# EAGLE design rc-driver-dual (EAGLE 7.2.0)
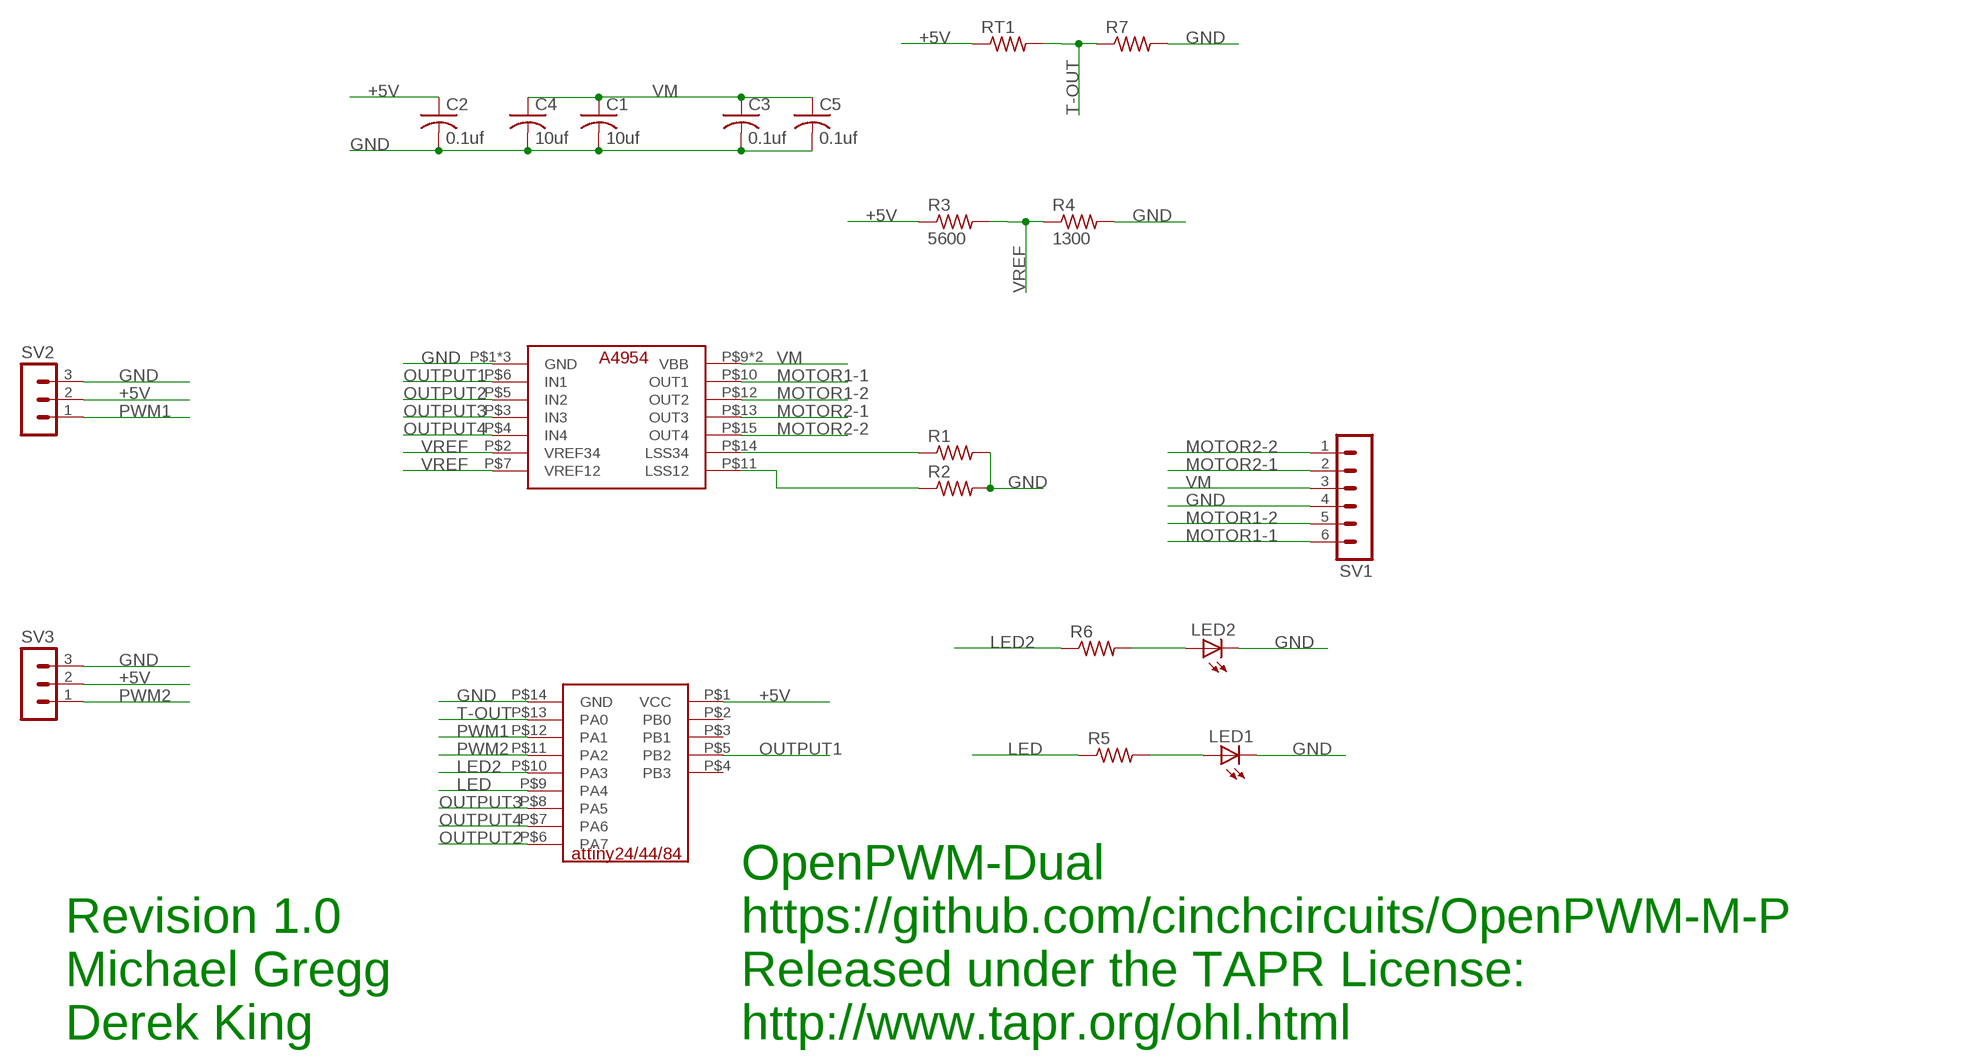
[diagram p0: schematic, sheet 1]

## Parts
C1  10uf  C-USC1206  [C1206]
C2  0.1uf  C-USC0603  [C0603]
C3  0.1uf  C-USC0603  [C0603]
C4  10uf  C-USC1206  [C1206]
C5  0.1uf  C-USC0603  [C0603]
LED1  LEDCHIPLED_0603  [CHIPLED_0603]
LED2  LEDCHIPLED_0603  [CHIPLED_0603]
R1  R-US_R0805W  [R0805W]
R2  R-US_R0805W  [R0805W]
R3  5600  R-US_R0603  [R0603]
R4  1300  R-US_R0603  [R0603]
R5  R-US_R0603  [R0603]
R6  R-US_R0603  [R0603]
R7  R-US_R0603  [R0603]
RT1  R-US_R0603  [R0603]
SV1  MA06-1  [MA06-1]
SV2  MA03-1  [MA03-1]
SV3  MA03-1  [MA03-1]
U$1  ATTINY24A  [SOIC-14-WIDE]
U$2  A4954-DUAL-HBRIDGE  [TSSOP-16-LP]

## Nets
+5V: C2.1 R3.1 RT1.1 SV2.2 SV3.2 U$1.P$1(VCC)
GND: C1.2 C2.2 C3.2 C4.2 C5.2 LED1.C LED2.C R1.2 R2.2 R4.2 R7.2 SV1.4 SV2.3 SV3.3 U$1.P$14(GND) U$2.P$1(GND) U$2.P$8(GND) U$2.P$17(GND)
LED: R5.1 U$1.P$9(PA4)
LED2: R6.1 U$1.P$10(PA3)
MOTOR1-1: SV1.6 U$2.P$10(OUT1)
MOTOR1-2: SV1.5 U$2.P$12(OUT2)
MOTOR2-1: SV1.2 U$2.P$13(OUT3)
MOTOR2-2: SV1.1 U$2.P$15(OUT4)
N$1: R1.1 U$2.P$14(LSS34)
N$2: R2.1 U$2.P$11(LSS12)
N$3: LED2.A R6.2
N$4: LED1.A R5.2
OUTPUT1: U$1.P$5(PB2) U$2.P$6(IN1)
OUTPUT2: U$1.P$6(PA7) U$2.P$5(IN2)
OUTPUT3: U$1.P$8(PA5) U$2.P$3(IN3)
OUTPUT4: U$1.P$7(PA6) U$2.P$4(IN4)
PWM1: SV2.1 U$1.P$12(PA1)
PWM2: SV3.1 U$1.P$11(PA2)
T-OUT: R7.1 RT1.2 U$1.P$13(PA0)
VM: C1.1 C3.1 C4.1 C5.1 SV1.3 U$2.P$9(VBB) U$2.P$16(VBB)
VREF: R3.2 R4.1 U$2.P$2(VREF34) U$2.P$7(VREF12)
Unconnected: U$1.P$2(PB0) U$1.P$3(PB1) U$1.P$4(PB3)

## Notes on the sheet
- OpenPWM-Dual
- Revision 1.0 | https://github.com/cinchcircuits/OpenPWM-M-P
- Michael Gregg | Released under the TAPR License:
- Derek King | http://www.tapr.org/ohl.html

## Library data of the parts
C1-C5 = resistor:C-US: CAPACITOR, American symbol
LED1 LED2 = led:LED: LED OSRAM: - CHIPLED LG R971, LG N971, LY N971, LG Q971, LY Q971, LO R971, LY R971 LH N974, LH R974 LS Q976, LO Q976, LY Q976 LO Q996 - Hyper CHIPLED LW Q18S LB Q993, LB Q99A, LB R99A - SideLED LS A670, LO A670, LY A670, LG A670, LP A670 LB A673, LV A673, LT A673, LW A673 LH A674 LY A675 LS A676, LA A676, LO A676, LY A676, LW A676 LS A679, LY A679, LG A679 - Hyper Micro SIDELED® LS Y876, LA Y876, LO Y876, LY Y876 LT Y87S - SmartLED LW L88C, LW L88S LB L89C, LB L89S, LG L890 LS L89K, LO L89K, LY L89K LS L896, LA L896, LO L896, LY L896 - TOPLED LS T670, LO T670, LY T670, LG T670, LP T670 LSG T670, LSP T670, LSY T670, LOP T670, LYG T670 LG T671, LOG T671, LSG T671 LB T673, LV T673, LT T673, LW T673 LH T674 LS T676, LA T676, LO T676, LY T676, LB T676, LH T676, LSB T676, LW T676 LB T67C, LV T67C, LT T67C, LS T67K, LO T67K, LY T67K, LW E67C LS E67B, LA E67B, LO E67B, LY E67B, LB E67C, LV E67C, LT E67C LW T67C LS T679, LY T679, LG T679 LS T770, LO T770, LY T770, LG T770, LP T770 LB T773, LV T773, LT T773, LW T773 LH T774 LS E675, LA E675, LY E675, LS T675 LS T776, LA T776, LO T776, LY T776, LB T776 LHGB T686 LT T68C, LB T68C - Hyper Mini TOPLED® LB M676 - Mini TOPLED Santana® LG M470 LS M47K, LO M47K, LY M47K Source: http://www.osram.convergy.de LUXEON: - LUMILED® LXK2-PW12-R00, LXK2-PW12-S00, LXK2-PW14-U00, LXK2-PW14-V00 LXK2-PM12-R00, LXK2-PM12-S00, LXK2-PM14-U00 LXK2-PE12-Q00, LXK2-PE12-R00, LXK2-PE12-S00, LXK2-PE14-T00, LXK2-PE14-U00 LXK2-PB12-K00, LXK2-PB12-L00, LXK2-PB12-M00, LXK2-PB14-N00, LXK2-PB14-P00, LXK2-PB14-Q00 LXK2-PR12-L00, LXK2-PR12-M00, LXK2-PR14-Q00, LXK2-PR14-R00 LXK2-PD12-Q00, LXK2-PD12-R00, LXK2-PD12-S00 LXK2-PH12-R00, LXK2-PH12-S00 LXK2-PL12-P00, LXK2-PL12-Q00, LXK2-PL12-R00 Source: www.luxeon.com KINGBRIGHT: KA-3528ASYC Source: www.kingbright.com
R1-R7 RT1 = resistor:R-US_: RESISTOR, American symbol
SV1 = con-lstb:MA06-1: PIN HEADER; OC_FARNELL: unknown; OC_NEWARK: unknown
SV2 SV3 = con-lstb:MA03-1: PIN HEADER; OC_FARNELL: unknown; OC_NEWARK: unknown
U$1 = rc-parts:ATTINY24A
U$2 = rc-parts:A4954-DUAL-HBRIDGE

## Board
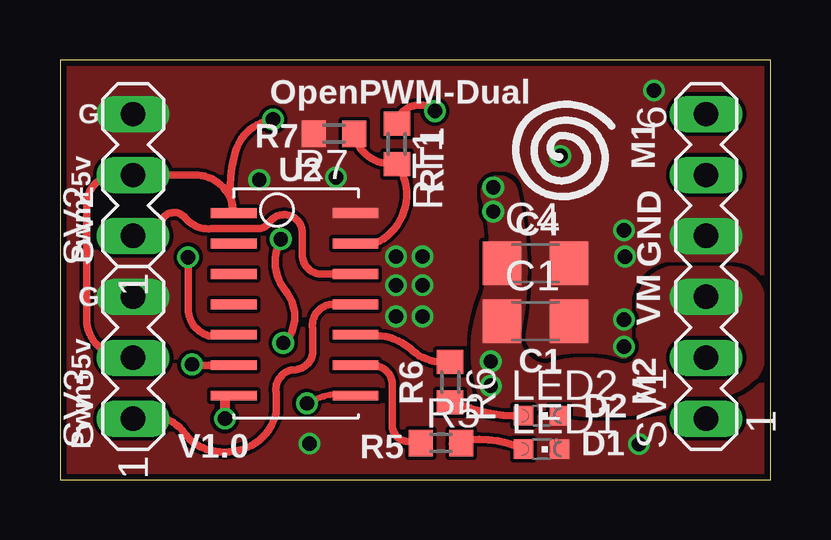
[diagram p1: board, top side]
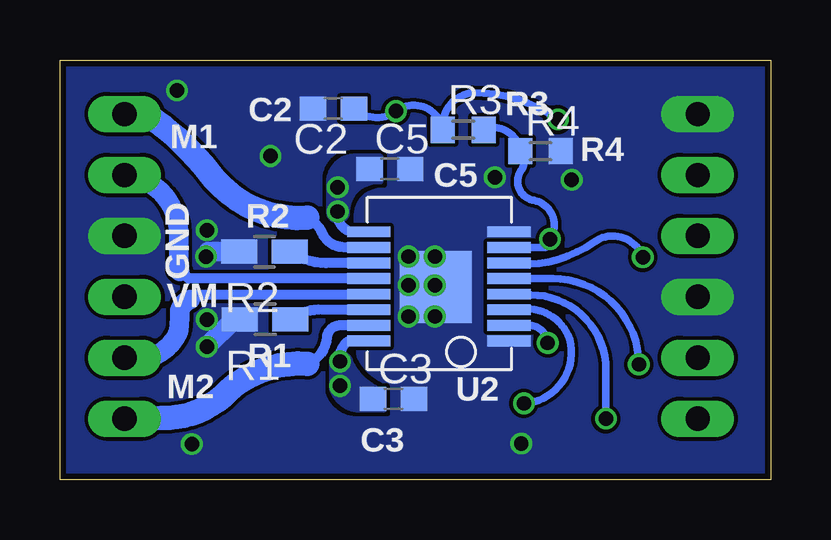
[diagram p2: board, bottom side, seen from below]

Size 29.62 x 17.5 mm. Coordinates in mm from the lower left corner, seen from the top.
Outline: 0,0 29.62,0 29.62,17.5 0,17.5 0,0
Copper layers (1*16): Top 0.035mm / dielectric 1.5mm / Bottom 0.035mm
Design rules "SeeedStudio_2layer_DRU_no_angle_20140221": minimum track width 6mil, minimum drill 12mil, track to track 6mil, track to pad 6mil, pad to pad 6mil, via to via 6mil, smd to smd 0mil, copper to edge 10mil, drill to drill 10mil, minimum pad ring 10mil, minimum via ring 6mil, stop-mask expansion 2mil, vias tented up to drill 100mil, thermal gap 10mil

### Footprints (pad centres in the part's own frame; a part is rotated, then mirrored left to right if it is on the bottom)
C1206 = smd 1.6 x 1.8: 1 -1.4,0; 2 1.4,0
C0603 = smd 1.1 x 1: 1 -0.85,0; 2 0.85,0
CHIPLED_0603 = smd 0.8 x 0.8: A 0,-0.75; C 0,0.75
R0805W = smd 1.5 x 1: 1 -1.052,0; 2 1.052,0
R0603 = smd 1 x 1.1: 1 -0.85,0; 2 0.85,0
MA06-1 = drill 1.016 long: 1 -6.35,0; 2 -3.81,0; 3 -1.27,0; 4 1.27,0; 5 3.81,0; 6 6.35,0
MA03-1 = drill 1.016 long: 1 -2.54,0; 2 0,0; 3 2.54,0
SOIC-14-WIDE = smd 0.4 x 1.9: P$1 -2.54,-2.54; P$2 -1.27,-2.54; P$3 0,-2.54; P$4 1.27,-2.54; P$5 2.54,-2.54; P$6 3.81,-2.54; P$7 5.08,-2.54; P$8 5.08,2.54; P$9 3.81,2.54; P$10 2.54,2.54; P$11 1.27,2.54; P$12 0,2.54; P$13 -1.27,2.54; P$14 -2.54,2.54
TSSOP-16-LP = smd 0.45 x 1.8: P$1 -2.07,-3.24; P$2 -1.42,-3.24; P$3 -0.77,-3.24; P$4 -0.12,-3.24; P$5 0.53,-3.24; P$6 1.18,-3.24; P$7 1.83,-3.24; P$8 2.48,-3.24; P$9 2.48,2.61; P$10 1.83,2.61; P$11 1.18,2.61; P$12 0.53,2.61; P$13 -0.12,2.61; P$14 -0.77,2.61; P$15 -1.42,2.61; P$16 -2.07,2.61 | smd 3 x 3: P$17 0.18,-0.19

### Placement (x,y rotation side)
C1  19.81,6.6 0 top
C2  18.23,15.48 180 bottom
C3  15.72,3.36 0 bottom
C4  19.81,9.02 0 top
C5  15.88,12.95 0 bottom
LED1  GREEN  [CHIPLED_0603]  20.07,1.27 270 top
LED2  RED  [CHIPLED_0603]  20.07,2.67 270 top
R1  0.047  [R0805W]  21.07,6.68 180 bottom
R2  0.047  [R0805W]  21.09,9.51 180 bottom
R3  12.82,14.59 0 bottom
R4  9.6,13.7 0 bottom
R5  360  [R0603]  15.88,1.52 0 top
R6  360  [R0603]  16.26,4.06 270 top
R7  11.42,14.42 180 top
RT1  14.04,14 270 top
SV1  26.92,8.89 90 top
SV2  3.05,12.7 90 top
SV3  3.05,5.08 90 top
U$1  9.78,8.57 270 top
U$2  14.15,7.85 90 bottom

### Tracks (layer width: path | path; a pad name or v marks a point on that pad's centre or on a via)
+5V  (via drill 0.6)
  Top 0.305: v8.87,15.02 arc73 7.24,13.38 arc30 U$1.P$1 arc90 5.59,12.7 SV2.2 2.32,12.7 arc90 1.11,11.44 1.11,6.54 arc90 SV3.2 | RT1.1 arc-121 v15.62,15.37
  Bottom 0.305: v8.87,15.02 arc-37 12.45,16.13 arc-90 R3.1 arc-117 v15.62,15.37 arc81 C2.1
GND  (via drill 0.6)
  Bottom 0.813: R1.2 22.36,6.68 v23.5,5.55 | v23.54,9.3 23.44,9.51 R2.2
  other vias: 15.1,9.3 14,8.1 15.1,8.1 14,6.8 15.1,6.8 23.5,6.67 23.5,10.4 24.75,16.23 24.13,1.48 20.85,13.49 8.3,12.5 10.4,1.5 11.5,12.6 14,9.3
  pour Bottom (rank 2, no thermals): 29.61,0 29.61,17.52 0,17.52 0,0
  pour Top (rank 2, no thermals): 29.61,17.52 0,17.52 0,0 29.61,0
LED
  Top 0.305: U$1.P$9 13.02,4.76 arc-80 13.84,4.06 13.84,2.29 arc82 14.4,1.6 R5.1
LED2
  Top 0.305: R6.1 arc-48 14.71,5.36 arc43 13.17,6 12.35,6 arc-90 U$1.P$10
MOTOR1-1
  Bottom 0.406: U$2.P$10 17.78,9.68 17.9,9.7 arc62 18.7,10.3 arc-37 19.32,10.92
  Bottom 0.813: SV1.6 26.66,15.2
  Bottom 1.016: 19.32,10.92 arc53 23.18,12.52 arc-19 25.96,15.2 26.66,15.2
MOTOR1-2
  Bottom 0.406: U$2.P$12 24.26,8.38 24.32,8.44 24.32,8.46 24.63,8.67
  Bottom 0.813: 24.63,8.67 24.68,8.73 24.68,10.08 arc-83 26.7,12.68 SV1.5
MOTOR2-1
  Bottom 0.406: U$2.P$13 16.79,7.7 23.96,7.7 24.13,7.62 24.27,7.53 24.19,7.51
  Bottom 0.813: 24.19,7.51 arc-60 24.64,6.99 arc8 24.67,6.22 arc85 26.9,5.08
  Bottom 1.016: 26.9,5.08 SV1.2
MOTOR2-2
  Bottom 0.406: U$2.P$15 17.92,6.43 arc-89 18.5,5.9 arc62 19.32,4.83
  Bottom 1.016: 19.32,4.83 arc-46 22.59,3.71 arc49 25.38,2.58 SV1.1
N$1
  Bottom 0.406: U$2.P$14 18.68,7.08 arc-41 R1.1
N$2
  Bottom 0.406: U$2.P$11 18.55,9.03 arc36 R2.1
N$3
  Top 0.305: R6.2 arc90 16.82,3.08 arc25 LED2.A
N$4
  Top 0.305: R5.2 arc90 16.35,1.5 arc-42 LED1.A
OUTPUT1  (via drill 0.6)
  Top 0.305: U$1.P$5 arc-90 7.2,6 6.2,6 arc-73 5.33,7.11 v5.33,9.27
  Bottom 0.305: v5.33,9.27 arc-107 7.37,9.91 arc44 U$2.P$6
OUTPUT2  (via drill 0.6)
  Top 0.305: U$1.P$6 5.54,4.76 arc-90 v5.5,4.8
  Bottom 0.305: v5.5,4.8 arc-90 9.08,8.38 U$2.P$5
OUTPUT3  (via drill 0.6 pad 0.61)
  Top 0.254: U$1.P$8 12.26,3.56 arc36 v10.29,3.17
  Bottom 0.254: v10.29,3.17 10.33,3.22
  Bottom 0.305: 10.33,3.22 arc-89 v10.29,3.17 arc-101 8.38,5.84 arc-68 10.03,7.11 10.5,7.08 U$2.P$3
OUTPUT4  (via drill 0.6)
  Top 0.406: U$1.P$7 6.87,3.49 v6.87,2.54
  Bottom 0.305: v6.87,2.54 6.87,4.57 arc-90 10,7.7 10.88,7.7 arc90 U$2.P$4
PWM1
  Top 0.305: SV2.1 4.32,10.16 arc-183 5.21,10.92 arc56 6.3,10.46 8.26,10.46 arc54 8.7,10.7 arc-146 10.1,10.3 10.1,9.3 arc87 10.93,8.57 U$1.P$12
PWM2
  Top 0.305: SV3.1 arc-77 5.21,1.91 arc37 6.1,1.27 arc38 7.62,1.27 arc60 9.02,2.79 9.02,3.56 arc-90 9.65,4.57 arc90 10.54,5.33 10.54,6.22 arc-111 11.49,7.3 U$1.P$11
T-OUT
  Top 0.305: U$1.P$13 13.09,9.84 arc102 RT1.2 14.1,13.21 arc-92 R7.1
VM  (via drill 0.6)
  Bottom 0.406: U$2.P$16 17.6,5.78 arc-64 v17.95,4.93 | U$2.P$9 17.46,10.33 arc87 v18.05,11.18
  other vias: 18.05,12.19 17.95,3.91
  pour Top (no thermals): 27.69,8.76 25.4,8.76 arc74 24.13,7.24 24.13,5.21 arc-90 23.37,4.7 arc40 20.32,4.7 arc-90 19.05,5.97 arc26 18.92,12.06 arc159 17.65,11.94 arc-42 17.53,7.11 arc35 17.53,3.68 arc86 19.81,3.05 arc29 25.78,3.17 arc40 28.96,4.32 arc54 29.21,7.75 arc79
  pour Bottom (no thermals): 16.13,3.68 arc53 17.53,4.95 arc-143 18.29,4.95 18.29,3.81 arc-72 17.14,2.92 16.13,2.92
  pour Bottom (no thermals): 16.26,12.45 16.26,13.46 17.27,13.46 arc-90 18.41,12.45 18.41,11.18 arc-180 17.65,11.18 arc95
VREF  (via drill 0.6)
  Top 0.305: v9.3,5.7 9.4,5.71 arc78 9.4,7.87 9.38,7.89 arc-63 9.14,9.91 v9.2,10.03 9.3,9.9
  Bottom 0.305: R3.2 arc105 R4.1 arc77 10.4,12.9 arc-117 9.87,11.65 arc117 9.25,9.95 arc-90 v9.2,10.03 arc90 9.42,9.68 U$2.P$7 | U$2.P$2 10.2,6.43 arc94 v9.3,5.7

### Text on the board
tPlace: OpenPWM-Dual | G | RT1 | R7 | M1 | +5v | U2 | C4 | Pwm | GND | G | VM | C1 | +5v | R6 | D2 | M2 | Pwm | V1.0 | R5 | D1
bPlace: R3 | C2 | M1 | R4 | C5 | GND | R2 | VM | R1 | U2 | M2 | C3